# Altium project MACHINE_EMBBED_V1I2.PrjPcb (part 3 of 3)
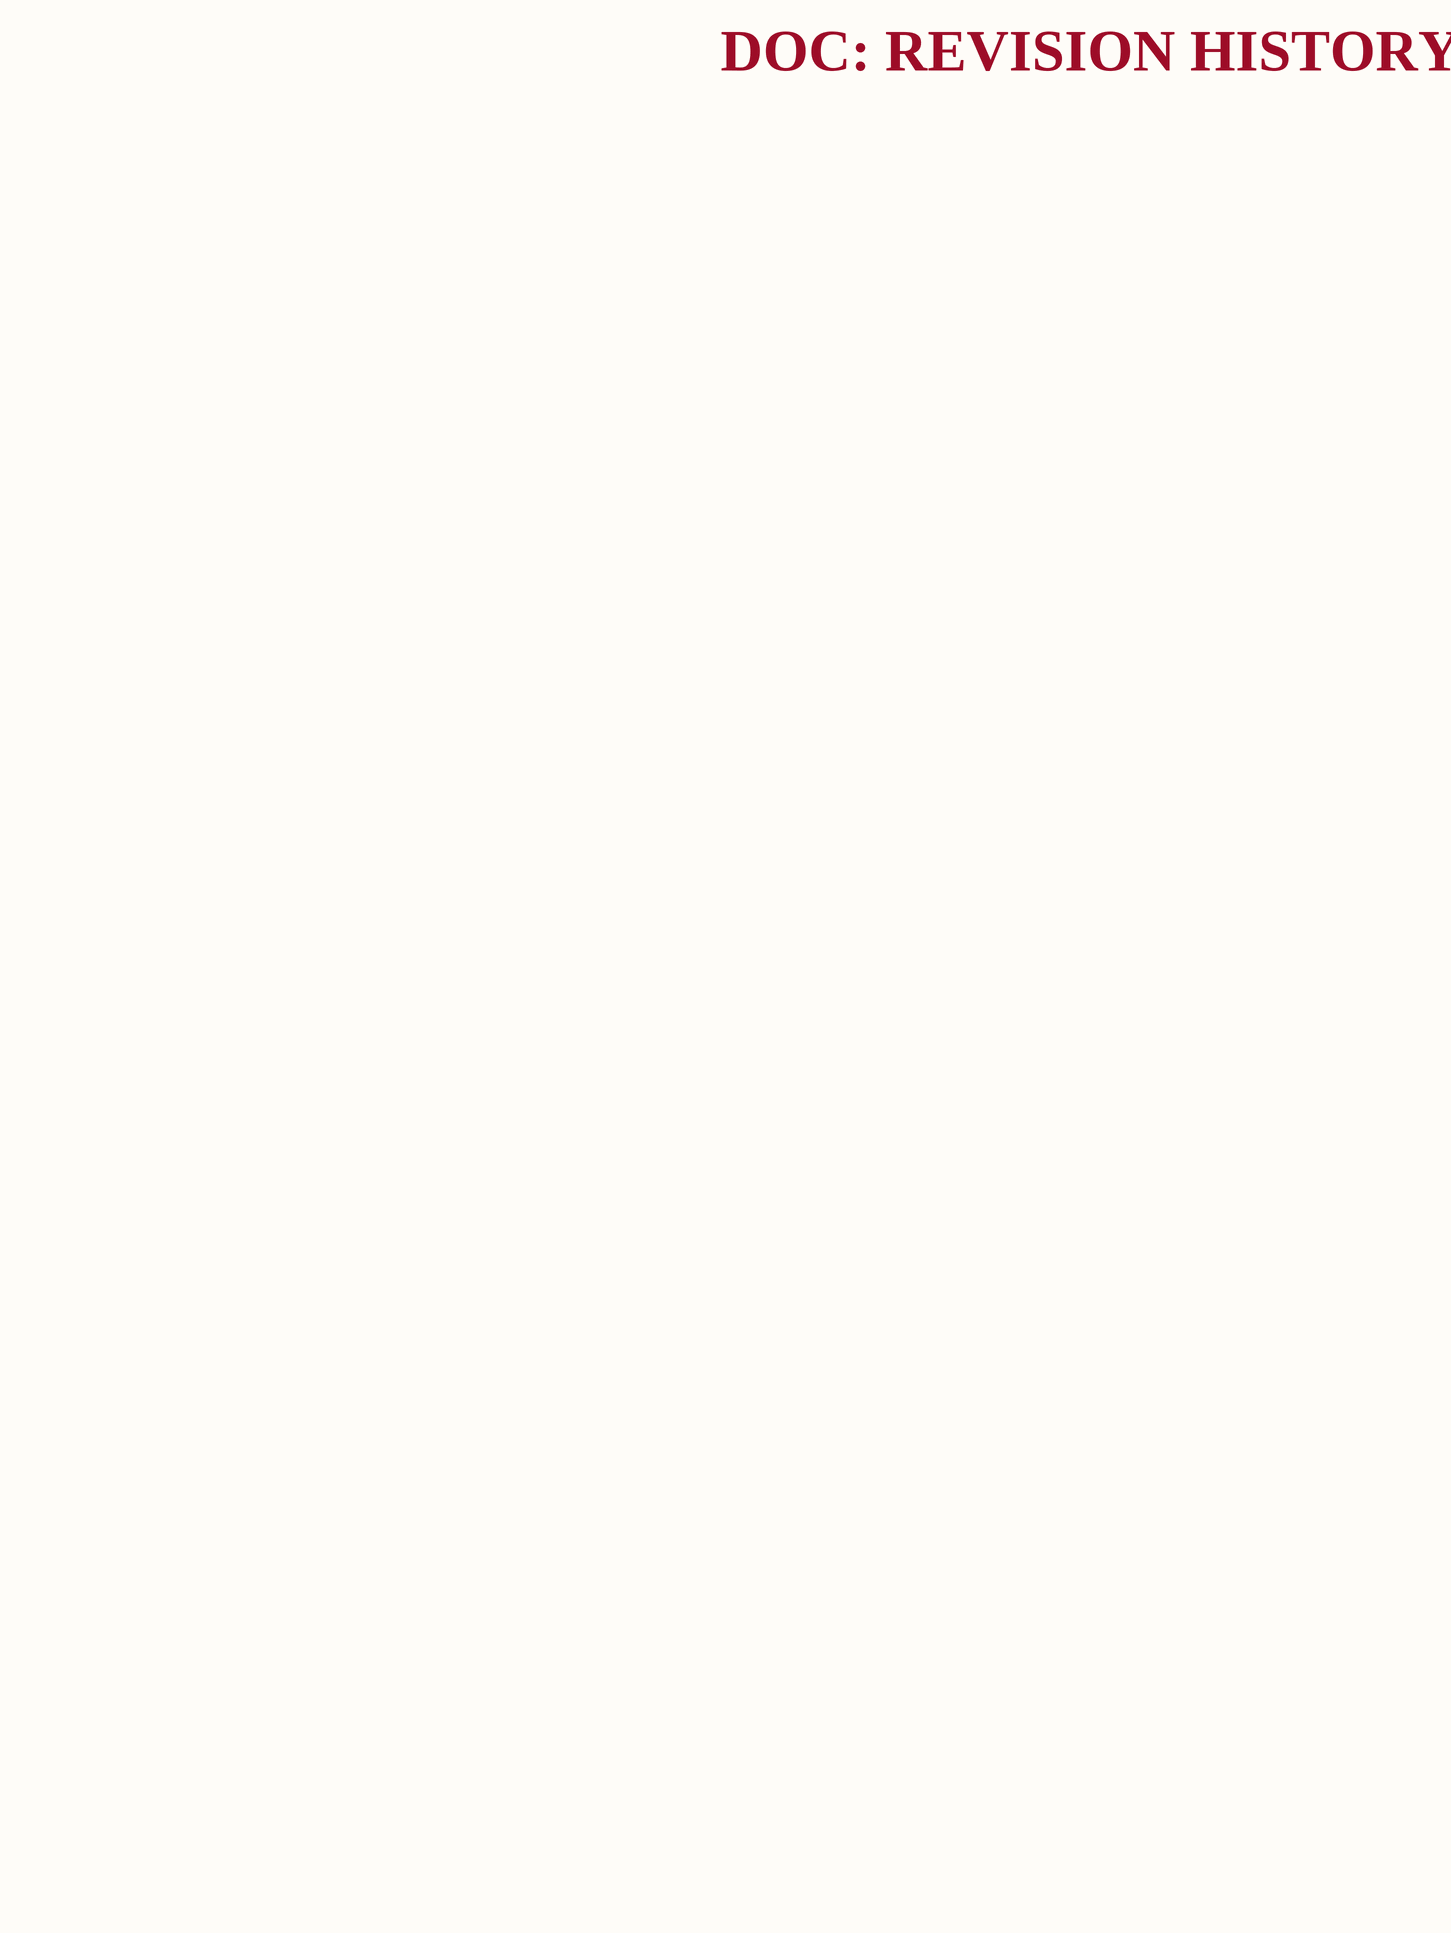
[diagram p14: [12] - DOC REVISION HISTORY.SchDoc]

## Nets that join several sheets
DDR_VREF: [04] - PROCESSOR 1 of 3, JTAG HEADER (C24.1 U3.J4), [08] - DDR3 MEMORY (6 pins)
GND_OSC0: [03] - POWER MANAGEMENT (28 pins), [04] - PROCESSOR 1 of 3, JTAG HEADER (12 pins), [05] - PROCESSOR 2 of 3, USB and SERIAL (10 pins), [06] - PROCESSOR 3 of 3. EXPANSION (102 pins), [08] - DDR3 MEMORY (42 pins)
USB_DC: [03] - POWER MANAGEMENT (C1.1 U1.12), [05] - PROCESSOR 2 of 3, USB and SERIAL (C29.1 P1.1 R24.1 U6.6)
VCC_ADC: [05] - PROCESSOR 2 of 3, USB and SERIAL (R17.2), [06] - PROCESSOR 3 of 3. EXPANSION (C85.1 FB2.1 U3.D8)
VDD_1V8: [03] - POWER MANAGEMENT (C10.2 R3.2 U1.40), [06] - PROCESSOR 3 of 3. EXPANSION (8 pins)
VDD_3V3A: [03] - POWER MANAGEMENT (C11.2 R1.2 U1.43 U2.1), [06] - PROCESSOR 3 of 3. EXPANSION (41 pins)
VDD_3V3B: [03] - POWER MANAGEMENT (C16.1 R9.2 U2.3), [05] - PROCESSOR 2 of 3, USB and SERIAL (C28.2 R16.2 U5.7 U5.8)
VDD_CORE: [03] - POWER MANAGEMENT (C9.2 L3.2 U1.29), [06] - PROCESSOR 3 of 3. EXPANSION (36 pins)
VDD_MPU: [03] - POWER MANAGEMENT (C7.2 L2.2 U1.24), [06] - PROCESSOR 3 of 3. EXPANSION (11 pins)
VDDS: [03] - POWER MANAGEMENT (R3.1 R6.2), [06] - PROCESSOR 3 of 3. EXPANSION (13 pins)
VDDS_DDR: [03] - POWER MANAGEMENT (C5.2 R2.2), [06] - PROCESSOR 3 of 3. EXPANSION (16 pins), [08] - DDR3 MEMORY (36 pins)
VRTC: [03] - POWER MANAGEMENT (C13.2 R5.2), [05] - PROCESSOR 2 of 3, USB and SERIAL (R15.2), [06] - PROCESSOR 3 of 3. EXPANSION (C96.1 U3.D7)
DDR_A0: [04] - PROCESSOR 1 of 3, JTAG HEADER (U3.F3), [08] - DDR3 MEMORY (U?.N3)
DDR_A1: [04] - PROCESSOR 1 of 3, JTAG HEADER (U3.H1), [08] - DDR3 MEMORY (U?.P7)
DDR_A2: [04] - PROCESSOR 1 of 3, JTAG HEADER (U3.E4), [08] - DDR3 MEMORY (U?.P3)
DDR_A3: [04] - PROCESSOR 1 of 3, JTAG HEADER (U3.C3), [08] - DDR3 MEMORY (U?.N2)
DDR_A4: [04] - PROCESSOR 1 of 3, JTAG HEADER (U3.C2), [08] - DDR3 MEMORY (U?.P8)
DDR_A5: [04] - PROCESSOR 1 of 3, JTAG HEADER (U3.B1), [08] - DDR3 MEMORY (U?.P2)
DDR_A6: [04] - PROCESSOR 1 of 3, JTAG HEADER (U3.D5), [08] - DDR3 MEMORY (U?.R8)
DDR_A7: [04] - PROCESSOR 1 of 3, JTAG HEADER (U3.E2), [08] - DDR3 MEMORY (U?.R2)
DDR_A8: [04] - PROCESSOR 1 of 3, JTAG HEADER (U3.D4), [08] - DDR3 MEMORY (U?.T8)
DDR_A9: [04] - PROCESSOR 1 of 3, JTAG HEADER (U3.C1), [08] - DDR3 MEMORY (U?.R3)
DDR_A10: [04] - PROCESSOR 1 of 3, JTAG HEADER (U3.F4), [08] - DDR3 MEMORY (U?.L7)
DDR_A11: [04] - PROCESSOR 1 of 3, JTAG HEADER (U3.F2), [08] - DDR3 MEMORY (U?.R7)
DDR_A12: [04] - PROCESSOR 1 of 3, JTAG HEADER (U3.E3), [08] - DDR3 MEMORY (U?.N7)
DDR_A13: [04] - PROCESSOR 1 of 3, JTAG HEADER (U3.H3), [08] - DDR3 MEMORY (U?.T3)
DDR_A14: [04] - PROCESSOR 1 of 3, JTAG HEADER (U3.H4), [08] - DDR3 MEMORY (U?.T7)
DDR_A15: [04] - PROCESSOR 1 of 3, JTAG HEADER (U3.D3), [08] - DDR3 MEMORY (U?.M7)
DDR_BA0: [04] - PROCESSOR 1 of 3, JTAG HEADER (U3.C4), [08] - DDR3 MEMORY (U?.M2)
DDR_BA1: [04] - PROCESSOR 1 of 3, JTAG HEADER (U3.E1), [08] - DDR3 MEMORY (U?.N8)
DDR_BA2: [04] - PROCESSOR 1 of 3, JTAG HEADER (U3.B3), [08] - DDR3 MEMORY (U?.M3)
DDR_CASn: [04] - PROCESSOR 1 of 3, JTAG HEADER (U3.F1), [08] - DDR3 MEMORY (U?.K3)
DDR_CKE: [04] - PROCESSOR 1 of 3, JTAG HEADER (U3.G3), [08] - DDR3 MEMORY (R?#1.2 U?.K9)
DDR_D0: [04] - PROCESSOR 1 of 3, JTAG HEADER (U3.M3), [08] - DDR3 MEMORY (U?.E3)
DDR_D1: [04] - PROCESSOR 1 of 3, JTAG HEADER (U3.M4), [08] - DDR3 MEMORY (U?.F7)
DDR_D2: [04] - PROCESSOR 1 of 3, JTAG HEADER (U3.N1), [08] - DDR3 MEMORY (U?.F2)
DDR_D3: [04] - PROCESSOR 1 of 3, JTAG HEADER (U3.N2), [08] - DDR3 MEMORY (U?.F8)
DDR_D4: [04] - PROCESSOR 1 of 3, JTAG HEADER (U3.N3), [08] - DDR3 MEMORY (U?.H3)
DDR_D5: [04] - PROCESSOR 1 of 3, JTAG HEADER (U3.N4), [08] - DDR3 MEMORY (U?.H8)
DDR_D6: [04] - PROCESSOR 1 of 3, JTAG HEADER (U3.P3), [08] - DDR3 MEMORY (U?.G2)
DDR_D7: [04] - PROCESSOR 1 of 3, JTAG HEADER (U3.P4), [08] - DDR3 MEMORY (U?.H7)
DDR_D8: [04] - PROCESSOR 1 of 3, JTAG HEADER (U3.J1), [08] - DDR3 MEMORY (U?.D7)
DDR_D9: [04] - PROCESSOR 1 of 3, JTAG HEADER (U3.K1), [08] - DDR3 MEMORY (U?.C3)
DDR_D10: [04] - PROCESSOR 1 of 3, JTAG HEADER (U3.K2), [08] - DDR3 MEMORY (U?.C8)
DDR_D11: [04] - PROCESSOR 1 of 3, JTAG HEADER (U3.K3), [08] - DDR3 MEMORY (U?.C2)
DDR_D12: [04] - PROCESSOR 1 of 3, JTAG HEADER (U3.K4), [08] - DDR3 MEMORY (U?.A7)
DDR_D13: [04] - PROCESSOR 1 of 3, JTAG HEADER (U3.L3), [08] - DDR3 MEMORY (U?.A2)
DDR_D14: [04] - PROCESSOR 1 of 3, JTAG HEADER (U3.L4), [08] - DDR3 MEMORY (U?.B8)
DDR_D15: [04] - PROCESSOR 1 of 3, JTAG HEADER (U3.M1), [08] - DDR3 MEMORY (U?.A3)
DDR_DQM0: [04] - PROCESSOR 1 of 3, JTAG HEADER (U3.M2), [08] - DDR3 MEMORY (U?.E7)
DDR_DQM1: [04] - PROCESSOR 1 of 3, JTAG HEADER (U3.J2), [08] - DDR3 MEMORY (U?.D3)
DDR_DQS0: [04] - PROCESSOR 1 of 3, JTAG HEADER (U3.P1), [08] - DDR3 MEMORY (U?.F3)
DDR_DQS1: [04] - PROCESSOR 1 of 3, JTAG HEADER (U3.L1), [08] - DDR3 MEMORY (U?.C7)
DDR_DQSN0: [04] - PROCESSOR 1 of 3, JTAG HEADER (U3.P2), [08] - DDR3 MEMORY (U?.G3)
DDR_DQSN1: [04] - PROCESSOR 1 of 3, JTAG HEADER (U3.L2), [08] - DDR3 MEMORY (U?.B7)
DDR_ODT: [04] - PROCESSOR 1 of 3, JTAG HEADER (U3.G1), [08] - DDR3 MEMORY (U?.K1)
DDR_RASn: [04] - PROCESSOR 1 of 3, JTAG HEADER (U3.G4), [08] - DDR3 MEMORY (U?.J3)
DDR_RESETn: [04] - PROCESSOR 1 of 3, JTAG HEADER (U3.G2), [08] - DDR3 MEMORY (R?#2.2 U?.T2)
DDR_WEn: [04] - PROCESSOR 1 of 3, JTAG HEADER (U3.B2), [08] - DDR3 MEMORY (U?.L3)
LDO_PGOOD: [03] - POWER MANAGEMENT (U1.46), [04] - PROCESSOR 1 of 3, JTAG HEADER (U3.B5)
PMIC_INT: [03] - POWER MANAGEMENT (R1.1 U1.45), [04] - PROCESSOR 1 of 3, JTAG HEADER (U3.B18)
PMIC_PGOOD: [03] - POWER MANAGEMENT (U1.26), [04] - PROCESSOR 1 of 3, JTAG HEADER (U3.B15)
PMIC_PWR_EN: [03] - POWER MANAGEMENT (U1.9), [05] - PROCESSOR 2 of 3, USB and SERIAL (U3.C6)
WAKEUP: [03] - POWER MANAGEMENT (U1.13), [05] - PROCESSOR 2 of 3, USB and SERIAL (R15.1 U3.C5)